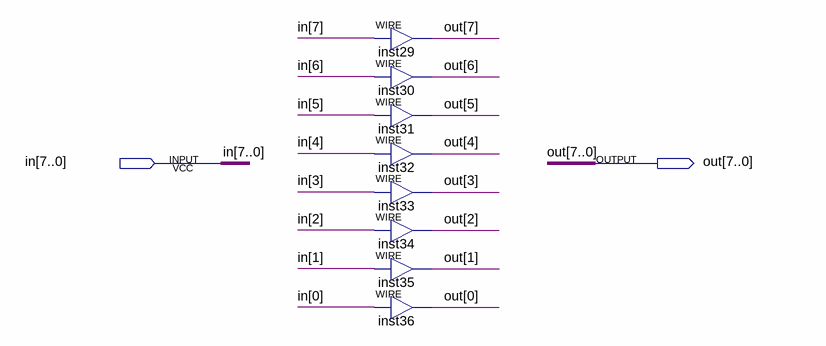
[diagram p0: schematic sheet]
// Quartus schematic buffer8.bdf as structural Verilog: 8 symbols, 2 pins
module buffer8 (
  input  [7:0] in,
  output [7:0] out
);

  assign out[7] = in[7];  // WIRE inst29
  assign out[6] = in[6];  // WIRE inst30
  assign out[5] = in[5];  // WIRE inst31
  assign out[4] = in[4];  // WIRE inst32
  assign out[3] = in[3];  // WIRE inst33
  assign out[2] = in[2];  // WIRE inst34
  assign out[1] = in[1];  // WIRE inst35
  assign out[0] = in[0];  // WIRE inst36
endmodule
